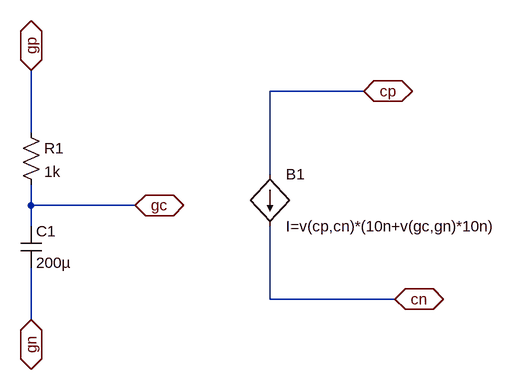
[diagram p0: schematic Capteur.asc]
Capteur.asc, the LTspice schematic file:
Version 4
SHEET 1 880 680
WIRE 560 16 416 16
WIRE 48 80 48 -16
WIRE 416 144 416 16
WIRE 48 192 48 160
WIRE 208 192 48 192
WIRE 48 224 48 192
WIRE 416 336 416 224
WIRE 608 336 416 336
WIRE 48 368 48 288
FLAG 208 192 gc
IOPIN 208 192 BiDir
FLAG 48 -16 gp
IOPIN 48 -16 BiDir
FLAG 48 368 gn
IOPIN 48 368 BiDir
FLAG 560 16 cp
IOPIN 560 16 BiDir
FLAG 608 336 cn
IOPIN 608 336 BiDir
SYMBOL res 32 64 R0
SYMATTR InstName R1
SYMATTR Value 1k
SYMBOL cap 32 224 R0
SYMATTR InstName C1
SYMATTR Value 200µ
SYMBOL bi 416 144 R0
SYMATTR InstName B1
SYMATTR Value I=v(cp,cn)*(10n+v(gc,gn)*10n)

The netlist it stands for:
* Capteur.asc
R1 gp gc 1k
C1 gc gn 200µ
B1 cp cn I=v(cp,cn)*(10n+v(gc,gn)*10n)
.backanno
.end